# Altium schematic sheet Misc.SchDoc
size A4; SheetNumber: 6; SheetTotal: 6
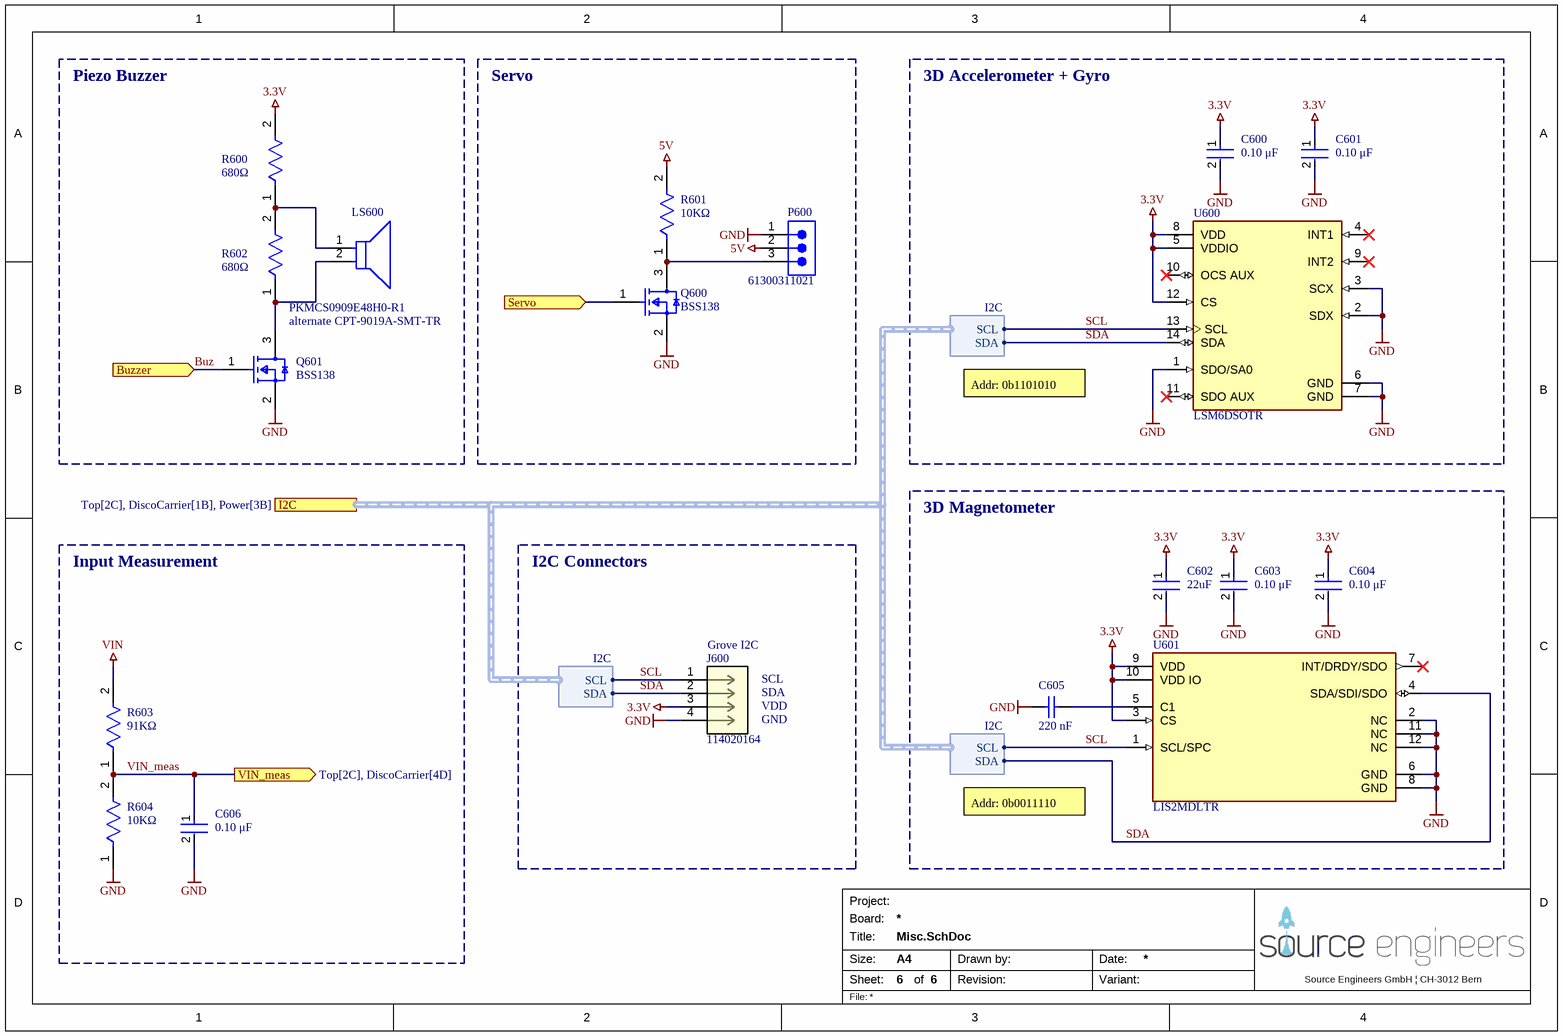
[diagram p0: Misc.SchDoc]

## Parts
C600  value 0.10 μF  [FP-C0603C-CF-MFG]  (hidden comment: C0603C104M5RACTU)
C601  value 0.10 μF  [FP-C0603C-CF-MFG]  (hidden comment: C0603C104M5RACTU)
C602  Capacitance: 22uF  [FP-GRM319-0_15-IPC_C]  (hidden comment: GRM319R61C226ME15D)
C603  value 0.10 μF  [FP-C0603C-CF-MFG]  (hidden comment: C0603C104M5RACTU)
C604  value 0.10 μF  [FP-C0603C-CF-MFG]  (hidden comment: C0603C104M5RACTU)
C605  value 220 nF  [CAPC1608X90X35NL15T15]  (hidden comment: C0603C224Z4VACTU)
C606  value 0.10 μF  [FP-C0603C-CF-MFG]  (hidden comment: C0603C104M5RACTU)
J600  114020164  [CONN4_20164_SEE]
LS600  PKMCS0909E48H0-R1  [FP-PKMCS0909E48H0-R1-MFG]
P600  61300311021  [61300311021]
Q600  BSS138  [FP-318-08-IPC_B]
Q601  BSS138  [FP-318-08-IPC_B]
R600  value 680Ω  [FP-RT0603-MFG]  (hidden comment: RT0603FRE07680RL)
R601  value 10KΩ  [FP-RT0603-MFG]  (hidden comment: RT0603FRE0710KL)
R602  value 680Ω  [FP-RT0603-MFG]  (hidden comment: RT0603FRE07680RL)
R603  Resistance: 91KΩ  [FP-RT0603-MFG]  (hidden comment: RT0603FRE0791KL)
R604  value 10KΩ  [FP-RT0603-MFG]  (hidden comment: RT0603FRE0710KL)
U600  LSM6DSOTR  [FP-LGA-14L-DM00249496-MFG]
U601  LIS2MDLTR  [FP-LGA-12-DM00170568-MFG]

## Blocks framed on the sheet
Piezo Buzzer: LS600 Q601 R600 R602
Servo: P600 Q600 R601
3D Accelerometer + Gyro: C600 C601 U600
3D Magnetometer: C602-C605 U601
Input Measurement: C606 R603 R604
I2C Connectors: J600

## Ports
Buzzer (in, see Top[2C], DiscoCarrier[1B]), I2C (harness I2C, see Top[2C], DiscoCarrier[1B], Power[3B]), Servo (in, see Top[2C], DiscoCarrier[1C]), VIN_meas (out, see Top[2C], DiscoCarrier[4D])

## Harnesses
I2C: SCL, SDA

## Nets
3.3V: C600.1 C601.1 C602.1 C603.1 C604.1 J600.3 R600.2 U600.5(VDDIO) U600.8(VDD) U600.12(CS) U601.3(CS) U601.9(VDD) U601.10(VDD_IO)
5V: P600.2 R601.2
GND: C600.2 C601.2 C602.2 C603.2 C604.2 C605.1 C606.2 J600.4 P600.1 Q600.2(S) Q601.2(S) R604.1 U600.1(SDO/SA0) U600.2(SDX) U600.3(SCX) U600.6(GND) U600.7(GND) U601.2(NC) U601.6(GND) U601.8(GND) U601.11(NC) U601.12(NC)
VIN: R603.2
Buz: Q601.1(G) ; port Buzzer
SCL: J600.1 U600.13(SCL) U601.1(SCL/SPC) ; port I2C.SCL
SDA: J600.2 U600.14(SDA) U601.4(SDA/SDI/SDO) ; port I2C.SDA
Servo: Q600.1(G) ; port Servo
VIN_meas: C606.1 R603.1 R604.2 ; port VIN_meas
NetC605_2: C605.2 U601.5(C1)
NetLS600_1: LS600.1 R600.1 R602.2
NetLS600_2: LS600.2 Q601.3(D) R602.1
NetP600_3: P600.3 Q600.3(D) R601.1

Not connected (* = marked no-connect by the designer): U600 4(INT1)* 9(INT2)* 10(OCS_AUX)* 11(SDO_AUX)*; U601 7(INT/DRDY/SDO)*

## Notes on the sheet
- alternate CPT-9019A-SMT-TR
- Addr: 0b1101010
- (near J600) Grove I2C
- SCL
- SDA
- VDD
- GND
- Addr: 0b0011110
- Project:
- Board:
- Title:
- Size:
- Sheet:
- A4
- of
- Drawn by:
- Revision:
- Date:
- Variant:
- Source Engineers GmbH | CH-3012 Bern
- File:

## Library data of the parts
C600 C601 C603 C604 C606 = CMP-2006-03068-2: CAP CER 0.1UF 50V 20% X7R 0603; Manufacturer: KEMET; Material: Ceramic; Tolerance: 0.2; Temperature Coefficient: 30ppm/°C; Automotive Grade: Grade 1; Temperature Range High: +125°C; Voltage Rating: 50 V; Device Class L3: Ceramic Capacitors; Manufacturer Part Number: C0603C104M5RACTU; Height: 0.87mm; Category: Cap; RoHS: TRUE; Digikey Description: CAP CER 0.1UF 50V 20% X7R 0603; ComponentLink2URL: https://api.kemet.com/component-edge/download/datasheet/C0603C100J5GACAUTO.pdf; Lead Free: Yes; Temperature Range Low: -55°C; Device Class L1: Passive Components; ComponentLink2Description: Datasheet; Temperature Characteristic: X7R; Automotive: Yes; Temperature: -55°C to +125°C; Octopart: https://octopart.com/c0603c104m5ractu-kemet-11855687; Device Class L2: Capacitors; Package: C0603C-CF; Mouser Description: Multilayer Ceramic Capacitors MLCC - SMD/SMT 50volts 0.1uF X7R 20%; Capacitance: 0.10 μF
C602 = CMP-06035-037955-1: Chip Multilayer Ceramic Capacitors for General Purpose, 1206, 22uF, X5R, 15%, 20%, 16V; Weight: 0.001411oz; Case/Package: 1206; Mount: Surface Mount; Voltage Rating (DC): 16V; Case Code (Metric): 3216; Height: 0.85mm; Package Quantity: 4000; Resistor Type: Ceramic; Thickness: 0.037inch; Packaging: Tape and Reel; Dielectric: X5R; Tolerance: 20%; Case Code (Imperial): 1206; Width: 0.063inch; Termination: SMD/SMT; Voltage Rating: 16V; Length: 0.126inch; Min Operating Temperature: -55°C; Max Operating Temperature: 85°C
C605 = CMP-2006-02254-1: Manufacturer: Kemet; Part Number: C0603C224Z4VACTU
J600 = 114020164: No Description Available; Manufacturer_Name: BeagleBoard; Copyright: Copyright (C) 2025 Ultra Librarian. All rights reserved.; Manufacturer_Part_Number: 114020164; RefDes: RefDes; Type: Type; Supplier 1: DigiKey; Supplier Part Number 1: 1597-114020164-ND; Supplier 2: Mouser; Supplier Part Number 2: 713-114020164
LS600 = CMP-06202-000041-1: 9.09.0MM 4.8KHZ PIEZOELECTRIC SO
P600 = CMP-1502-01061-3: NexarPartId: 32855520; Contact Resistance: 20mΩ; Number of Positions: 3; Current Rating: 3A; Gender: Male; Operating Supply Voltage: 250V; Connector Type: Male Pin; Pitch: 2.54mm; Number of Rows: 1; Lead Pitch: 2.54mm; REACH SVHC: Unknown; Packaging: Bulk; Mount: Through Hole; Number of Pins: 3; Color: Black; Contact Plating: Gold; Contact Material: Copper; Number of Contacts: 3; Contact Mating Length: 5.9944mm; Termination: Solder; RoHS: Compliant
Q600 Q601 = CMP-07173-000101-1: MOSFET N-CH 50V 220MA SOT-23; Turn-Off Delay Time: 20ns; Element Configuration: Single; Rds On Max: 3.5R; Gate to Source Voltage (Vgs): 20V; Threshold Voltage: 1.3V; Number of Elements: 1; Power Dissipation: 360mW; Rise Time: 9ns; Turn-On Delay Time: 2.5ns; Input Capacitance: 27pF; On-State Resistance: 6R; Lead Free: Lead Free; Length: 2.92mm; Width: 1.3mm; Drain to Source Breakdown Voltage: 50V; Min Operating Temperature: -55°C; REACH SVHC: No SVHC; Packaging: Tape and Reel; Radiation Hardening: No; Height: 0.93mm; Drain to Source Voltage (Vdss): 50V; Current Rating: 220mA; Voltage Rating (DC): 50V; Weight: 0.03g; Continuous Drain Current (ID): 220mA; Number of Pins: 3; Nominal Vgs: 1.3V; Max Power Dissipation: 360mW; Fall Time: 9ns; Drain to Source Resistance: 3.5R; Contact Plating: Tin; Case/Package: SOT-23; Package Quantity: 1; Dual Supply Voltage: 50V; Mount: Surface Mount; Termination: SMD/SMT; Max Operating Temperature: 150°C
R600 R602 = CMP-03412-003342-1: RES SMD 680 OHM 1% 1/10W 0603; Manufacturer: Yageo; Temperature Coefficient: 50 ppm/°C; Tolerance: 0.01; Power Rating: 0.1W; Voltage Rating: 75V; Temperature Range Low: -55°C; Device Class L2: Resistors; Digikey Description: RES SMD 680 OHM 1% 1/10W 0603; Composition: Thin Film; ComponentLink2Description: Datasheet; Footprint Url: http://www.yageo.com/exep/pages/download/literatures/PYu-R_Mount_10.pdf; Mouser Description: Thin Film Resistors - SMD 1/10W 680 ohm 1% 50ppm; Series: RT; Resistance: 680Ω; Temperature Range High: +155°C; Octopart: https://octopart.com/rt0603fre07680rl-yageo-40000084; RoHS: TRUE; Temperature: -55°C to +155°C; Device Class L1: Passive Components; ComponentLink2URL: http://www.yageo.com/documents/recent/PYu-RT_1-to-0.01_RoHS_L_9.pdf; Automotive: No; Ipc Land Pattern Name: RESC16080X45; Height: 0.55mm; Package: RT0603; Category: Res; Manufacturer Part Number: RT0603FRE07680RL; Device Class L3: Chip SMD Resistors; Lead Free: Yes
R601 R604 = CMP-03412-005349-1: RES SMD 10K OHM 1% 1/10W 0603; Manufacturer: Yageo; Temperature Coefficient: 50 ppm/°C; Power Rating: 0.1W; Tolerance: 0.01; Voltage Rating: 75V; RoHS: TRUE; Category: Res; Automotive: No; Digikey Description: RES SMD 10K OHM 1% 1/10W 0603; ComponentLink2Description: Datasheet; Octopart: https://octopart.com/rt0603fre0710kl-yageo-40009243; ComponentLink2URL: http://www.yageo.com/documents/recent/PYu-RT_1-to-0.01_RoHS_L_9.pdf; Device Class L3: Chip SMD Resistors; Device Class L1: Passive Components; Temperature Range High: +155°C; Height: 0.55mm; Composition: Thin Film; Ipc Land Pattern Name: RESC16080X45; Series: RT; Package: RT0603; Resistance: 10KΩ; Footprint Url: http://www.yageo.com/exep/pages/download/literatures/PYu-R_Mount_10.pdf; Temperature: -55°C to +155°C; Temperature Range Low: -55°C; Lead Free: Yes; Device Class L2: Resistors; Mouser Description: Thin Film Resistors - SMD 10K ohm 1% 1/10W; Manufacturer Part Number: RT0603FRE0710KL
R603 = CMP-2000-04807-2: RES SMD 91K OHM 1% 1/10W 0603; Manufacturer: Yageo; Voltage Rating: 75V; Tolerance: 0.01; Value: 91KΩ; Power Rating: 0.1W; Temperature Coefficient: 50 ppm/°C; Series: RT; RoHS: TRUE; ComponentLink2Description: Datasheet; Temperature: -55°C to +155°C; Device Class L2: Resistors; Height: 0.55mm; Footprint Url: http://www.yageo.com/exep/pages/download/literatures/PYu-R_Mount_10.pdf; Manufacturer Part Number: RT0603FRE0791KL; Device Class L1: Passive Components; Device Class L3: Chip SMD Resistors; Temperature Range High: +155°C; Lead Free: Yes; Mouser Description: Thin Film Resistors - SMD 1/10W 91K ohm 1% 50ppm; Automotive: No; Ipc Land Pattern Name: RESC16080X45; Digikey Description: RES SMD 91K OHM 1% 1/10W 0603; Package: RT0603; ComponentLink2URL: http://www.yageo.com/documents/recent/PYu-RT_1-to-0.01_RoHS_L_9.pdf; Composition: Thin Film; Octopart: https://octopart.com/rt0603fre0791kl-yageo-1246954; Category: Res; Temperature Range Low: -55°C
U600 = CMP-12177-000012-1: CONSUMER MEMS; Manufacturer: STMicroelectronics; Gyro Range: 125/250/500/1000/2000°/s; Max Supply Voltage: 3.6V; Sensor Output: I2C,SPI; Operating Supply Current: 0.55mA; Accel Range: 2/4/8/16g; Min Supply Voltage: 1.62V; Sensor Type: Temperature,Accelerometer,Gyroscope; Height: 0.86mm; Automotive: No; Device Class L3: Inertial Measurement Units (IMUs); Device Class L1: Sensors; ComponentLink2Description: Datasheet; Device Class L2: Motion Sensors; Temperature: -40°C to +85°C; Package: LGA-14L-DM00249496; Octopart: https://octopart.com/lsm6dsotr-stmicroelectronics-81706672; Temperature Range Low: -40°C; Digikey Description: CONSUMER MEMS; ComponentLink2URL: https://www.st.com/resource/en/datasheet/lsm6dso.pdf; Manufacturer Part Number: LSM6DSOTR; Mouser Description: iNEMO inertial module: "always-on" integrated 3D accelerometer and 3D gyroscope; Footprint Url: https://www.st.com/content/ccc/resource/technical/document/technical_note/73/17/9c/16/dd/96/4a/01/CD00134799.pdf/files/CD00134799.pdf/jcr:content/translations/en.CD00134799.pdf; Lead Free: Yes; RoHS: TRUE; Category: IC; Temperature Range High: +85°C
U601 = CMP-12173-000002-1: SENSOR MR I2C/SPI 12LGA; Manufacturer: STMicroelectronics; Sensing Method: Magnetic; Min Supply Voltage: 1.71V; Sensor Output: I2C,SPI; Operating Supply Current: 50-200uA; Max Supply Voltage: 3.6V; Octopart: https://octopart.com/lis2mdltr-stmicroelectronics-81117311; RoHS: TRUE; Device Class L3: unset; Device Class L1: Sensors; ComponentLink2URL: https://www.st.com/resource/en/datasheet/lis2mdl.pdf; Automotive: No; Device Class L2: Magnetic Sensors; Lead Free: Yes; Temperature: -40°C to +85°C; Manufacturer Part Number: LIS2MDLTR; Temperature Range High: +85°C; Height: 0.7mm; Digikey Description: SENSOR MR I2C/SPI 12LGA; Category: IC; ComponentLink2Description: Datasheet; Package: LGA-12-DM00170568; Temperature Range Low: -40°C